# EasyEDA Pro project 栏杆机费显主板.epro, board PCB1
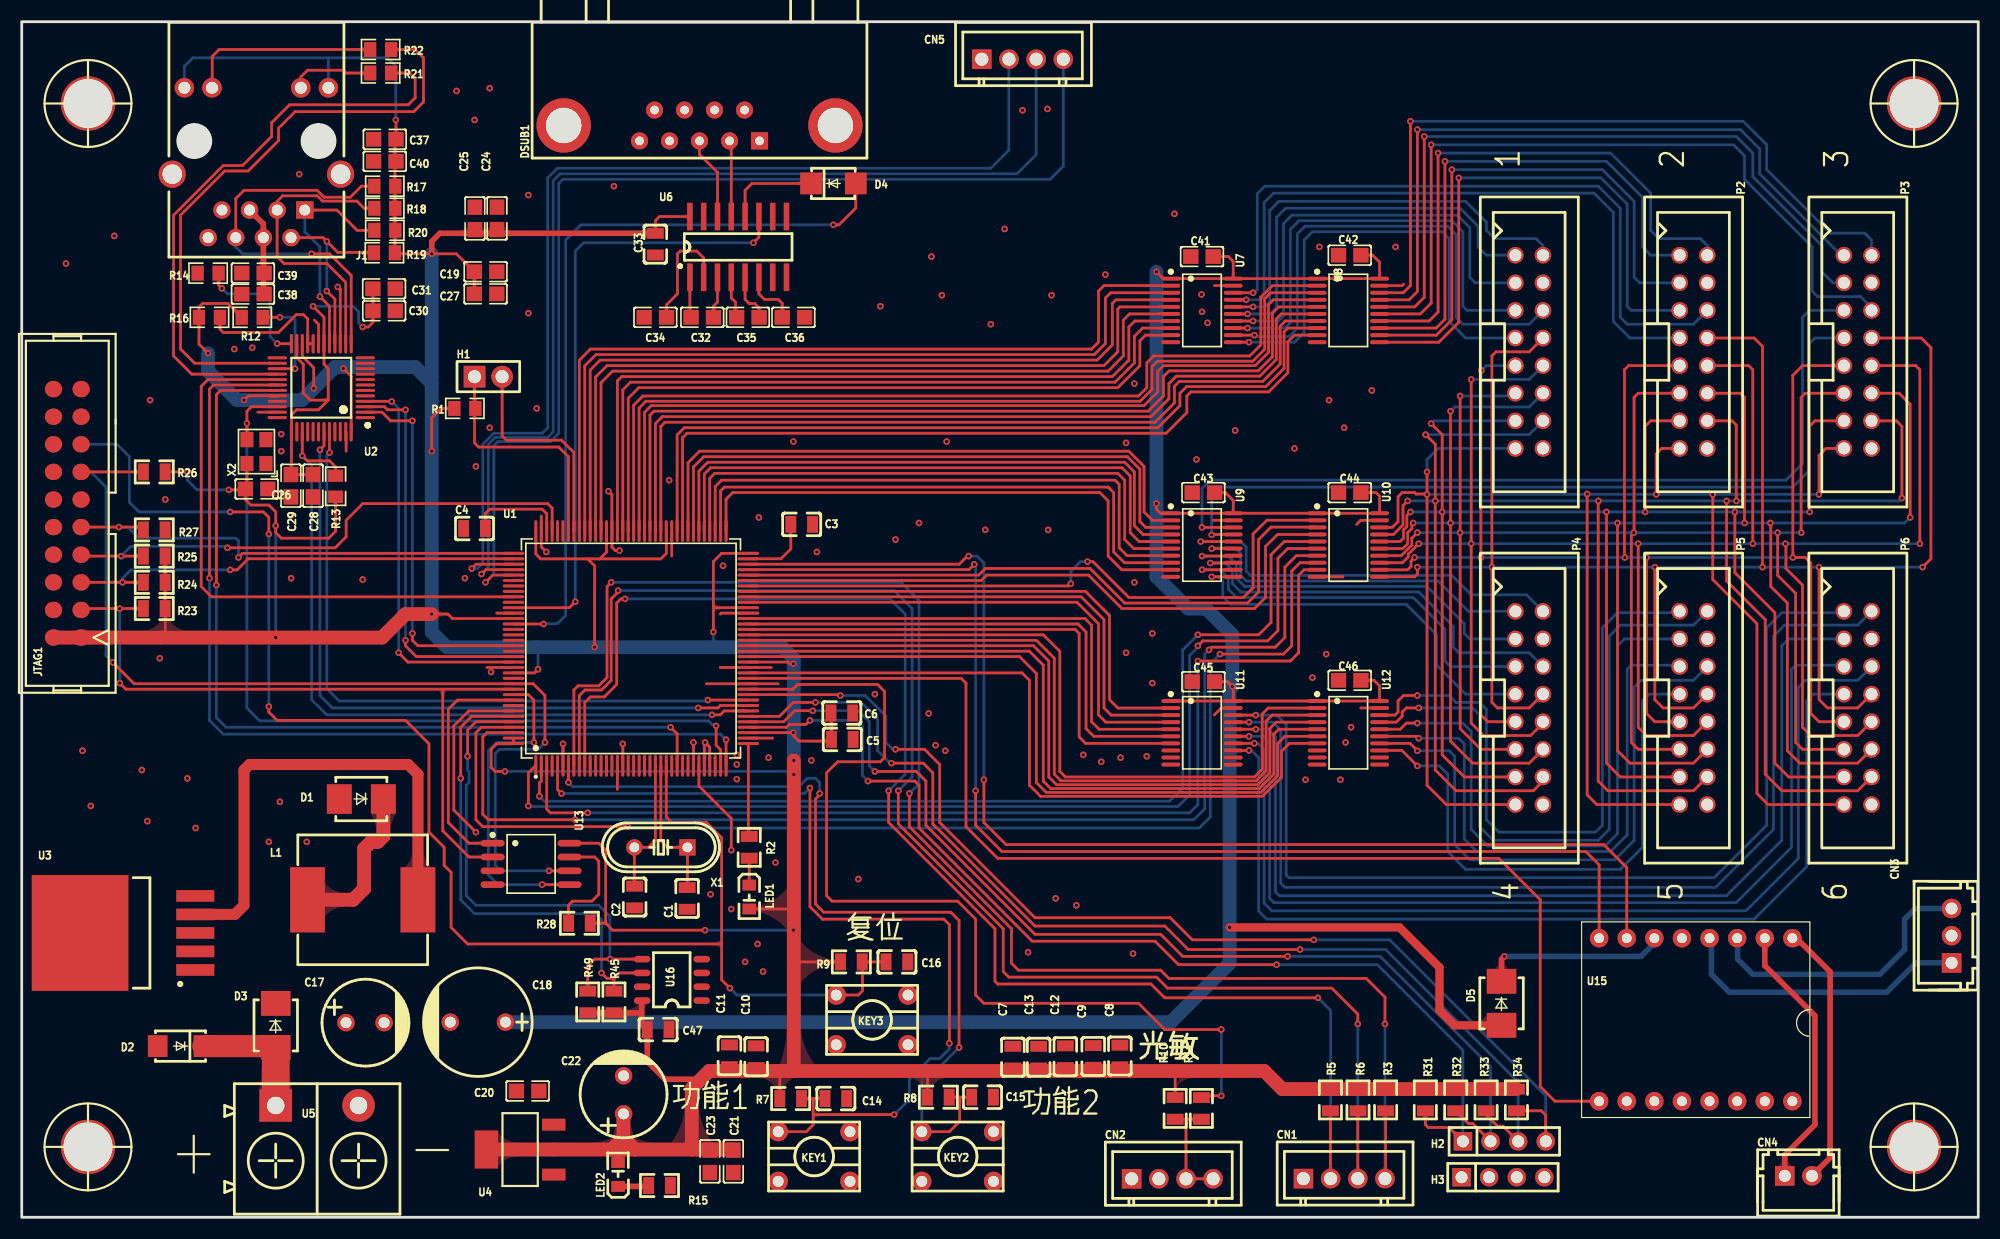
[diagram p3: board, top side]
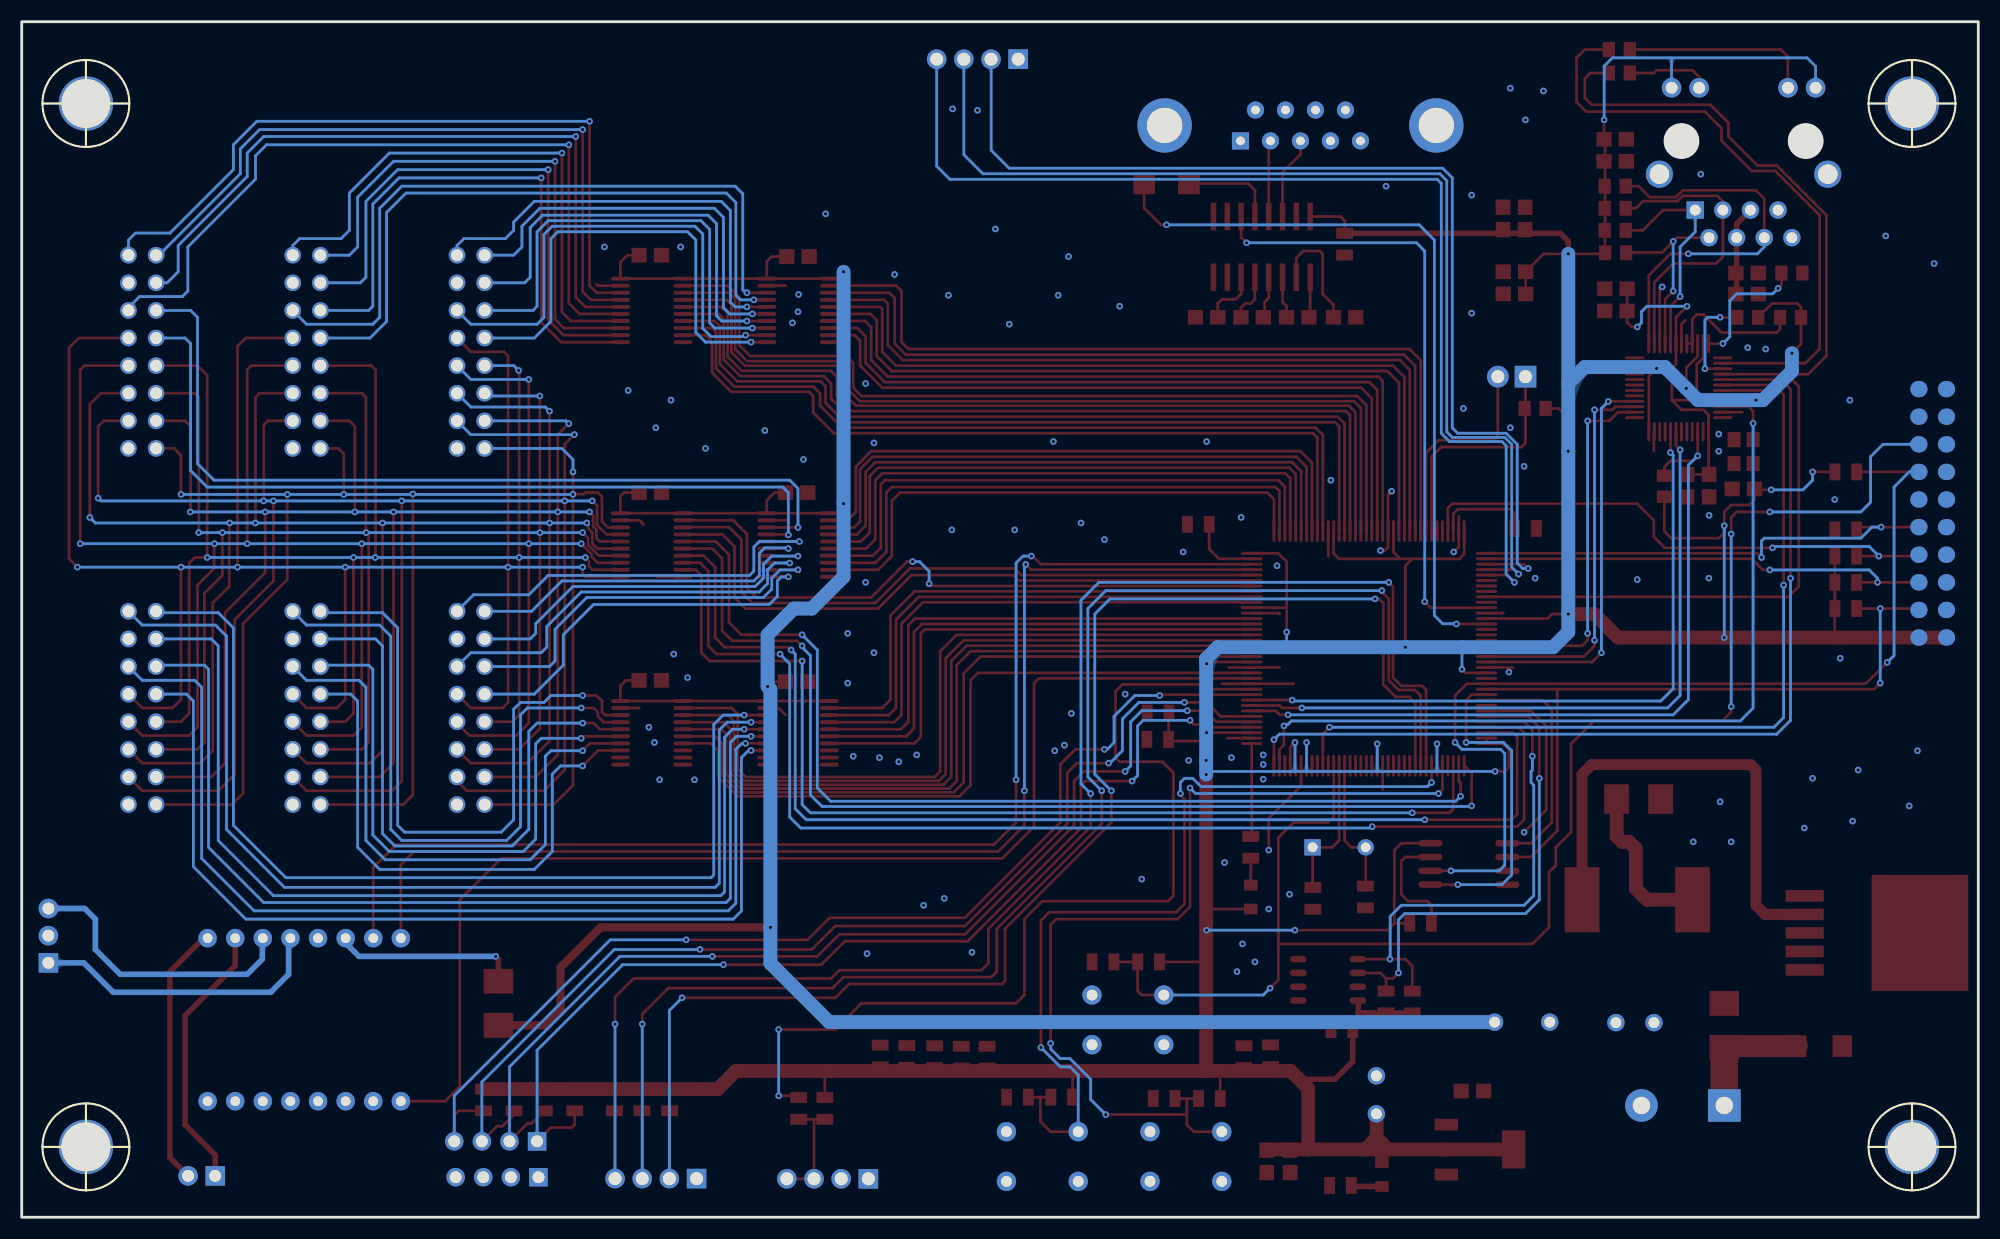
[diagram p4: board, bottom side, seen from below]

Outline 180 x 110 mm; copper layers: Top Layer, Bottom Layer. Coordinates in mm from the lower left corner of the outline.
Outline path: rectangle 0,110 180,0
Stack: Top Layer 0.035mm / Dielectric1 1.51mm FR4 er 4.5 / Bottom Layer 0.035mm

## Design rules (mm)
template: 自定义配置
spacing copperThickness1oz (default): track to track 0.102, other pairs 0.152 to 0.3
spacing copperThickness2oz: track to track 0.203, other pairs 0.152 to 0.3
track width copperThickness1oz (default): min 0.127, default 0.254, max 2.54
track width copperThickness2oz: min 0.203, default 0.254, max 2.54
differential pair differentialPair (default): width min 0.127, default 0.254, max 2.54; gap min 0.152, default 0.152
via viaSize (default): diameter min 0.5, default 0.61, max 10; hole min 0.3, default 0.305, max 6.299
net +5V uses 电源
net $2N1483 uses 电源
net +12V uses 电源

## Placement (name value [footprint] x y rotation side)
C1  22pF  [C0805]  61.21 29.34 90 top
C2  22pF  [C0805]  56.39 29.46 90 top
C3  225  [C0805]  71.75 63.75 180 top
C4  225  [C0805]  41.66 63.37 0 top
C5  104  [C0805]  75.49 43.97 180 top
C6  104  [C0805]  75.45 46.4 180 top
C7  104  [C0805]  91.19 14.73 270 top
C8  104  [C0805]  101.03 14.84 270 top
C9  104  [C0805]  98.58 14.79 270 top
C10  104  [C0805]  67.56 14.77 270 top
C11  104  [C0805]  65.11 14.86 270 top
C12  104  [C0805]  96.01 14.77 270 top
C13  225  [C0805]  93.56 14.73 90 top
C14  104  [C0805]  74.9 10.92 0 top
C15  104  [C0805]  88.39 11.05 0 top
C16  104  [C0805]  80.52 23.5 0 top
C17  330uF  [直插电容C1]  31.62 17.91 90 top
C18  1000uF  [直插电容2]  40.77 15.75 90 top
C19  104  [C0805#2]  42.67 87 0 top
C20  104  [C0805#2]  46.54 11.62 0 top
C21  106  [C0805#2]  65.47 5.14 90 top
C22  330uF  [直插电容C1]  55.37 11.3 180 top
C23  104  [C0805#2]  63.31 5.14 90 top
C24  104  [C0805#2]  43.73 91.91 270 top
C25  104  [C0805#2]  41.69 91.9 270 top
C26  104  [C0805#2]  21.61 67.01 180 top
C27  103  [C0805#2]  42.67 84.96 180 top
C28  104  [C0805#2]  26.8 67.31 90 top
C29  104  [C0805#2]  24.76 67.31 90 top
C30  104  [C0805#2]  33.34 83.4 180 top
C31  106  [C0805#2]  33.33 85.43 180 top
C32  104  [C0805#2]  62.61 82.8 180 top
C33  104  [C0805]  58.29 89.54 90 top
C34  104  [C0805#2]  58.29 82.8 0 top
C35  104  [C0805#2]  66.8 82.8 180 top
C36  104  [C0805#2]  70.99 82.8 180 top
C37  100nF  [C0805#2]  33.4 99.19 0 top
C38  104  [C0805#2]  21.27 84.94 180 top
C39  100nF  [C0805#2]  21.27 86.88 180 top
C40  100nF  [C0805#2]  33.4 97.16 0 top
C41  104  [C0805#2]  108.58 88.39 180 top
C42  104  [C0805#2]  122.17 88.52 180 top
C43  104  [C0805#2]  108.71 66.68 180 top
C44  104  [C0805#2]  122.17 66.68 180 top
C45  104  [C0805#2]  108.71 49.28 180 top
C46  104  [C0805#2]  122.17 49.4 180 top
C47  104  [C0805]  58.55 17.27 180 top
CN1  XH-4AK M  [CONN-TH_4P-P2.50_XH-4A]  121.67 3.56 0 top
CN2  XH-4AK M  [CONN-TH_4P-P2.50_XH-4A]  105.86 3.54 0 top
CN3  HX25003-3A  [CONN-TH_3P-P2.50_HX25003-3A]  177.55 25.91 270 top
CN4  HX25003-2A  [CONN-TH_2P-P2.50_HX25003-2A]  163.45 3.81 0 top
CN5  XH-4AK M  [CONN-TH_4P-P2.50_XH-4A]  92.07 106.55 0 top
D1  SS34-B  [SMB_L4.6-W3.6-LS5.3-RD]  31.24 38.48 180 top
D2  SMAJ25A_C466027  [SMA_L4.4-W2.8-LS5.4-RD]  14.6 15.75 180 top
D3  SS34-B  [SMB_L4.6-W3.6-LS5.3-RD]  23.37 17.65 270 top
D4  SS14  [SMA_L4.3-W2.6-LS5.2-FD]  74.68 95.12 180 top
D5  SS34-B  [SMB_L4.6-W3.6-LS5.3-RD]  136.14 19.69 270 top
DSUB1  DMR-9P  [DSUB-TH_DMR-9P]  62.36 100.46 90 top
H1  -  [HDR-TH_2P-P2.54-V-F]  42.93 77.34 0 top
H2  -  [HDR-TH_4P-P2.54-V-M]  136.4 6.99 0 top
H3  -  [HDR-TH_4P-P2.54-V-M]  136.27 3.68 0 top
J1  HY911105AE  [RJ45-TH_HR911105A]  21.59 97.03 180 top
JTAG1  JTAG  [JTAG_20]  4.19 64.77 90 top
KEY1  RESET  [按键]  77.85 8.51 180 top
KEY2  RESET  [按键]  91.06 8.51 180 top
KEY3  RESET  [按键]  83.19 21.08 180 top
L1  100uH  [IND-SMD_L12.0-W12.0_SLH1207S]  31.37 29.21 0 top
LED1  -  [LED0805-RD_RED]  66.93 29.46 270 top
LED2  -  [LED0805-RD_RED]  54.86 3.94 90 top
P1  2.54-2*8P简牛  [IDC-TH_16P-P2.54_C3406]  138.68 79.63 270 top
P2  2.54-2*8P简牛  [IDC-TH_16P-P2.54_C3406]  153.8 79.63 270 top
P3  2.54-2*8P简牛  [IDC-TH_16P-P2.54_C3406]  168.91 79.63 270 top
P4  2.54-2*8P简牛  [IDC-TH_16P-P2.54_C3406]  138.68 46.86 270 top
P5  2.54-2*8P简牛  [IDC-TH_16P-P2.54_C3406]  153.8 46.86 270 top
P6  2.54-2*8P简牛  [IDC-TH_16P-P2.54_C3406]  168.91 46.86 270 top
R1  10K  [R0805#2]  40.77 74.42 180 top
R2  270  [R0805]  66.93 34.04 90 top
R3  10K  [R0805]  125.48 10.8 90 top
R5  10K  [R0805]  120.4 10.8 90 top
R6  10K  [R0805]  122.94 10.8 90 top
R7  10K  [R0805]  70.74 10.92 0 top
R8  10K  [R0805]  84.33 11.05 0 top
R9  10K  [R0805]  76.33 23.5 0 top
R10  47K  [R0805]  106.11 10.02 270 top
R11  1K  [R0805]  108.53 10.02 270 top
R12  2.2K  [R0805#2]  21.21 82.8 180 top
R13  2.2K  [R0805#2]  28.88 67.26 90 top
R14  4.87K  [R0805#2]  17.15 86.87 0 top
R15  1K  [R0805]  58.67 2.92 0 top
R16  2.2K  [R0805#2]  17.27 82.8 180 top
R17  49.9R  [R0805#2]  33.4 94.87 180 top
R18  49.9R  [R0805#2]  33.4 92.84 180 top
R19  49.9R  [R0805#2]  33.37 88.74 0 top
R20  49.9R  [R0805#2]  33.4 90.81 0 top
R21  330R  [R0805#2]  33.02 105.28 180 top
R22  330R  [R0805#2]  33.02 107.44 180 top
R23  10K  [R0805]  12.19 56.01 0 top
R24  10K  [R0805]  12.19 58.42 0 top
R25  10K  [R0805]  12.19 60.83 0 top
R26  10K  [R0805]  12.19 68.58 0 top
R27  10K  [R0805]  12.19 63.25 0 top
R28  10K  [R0805]  51.31 27.05 180 top
R31  10K  [R0805]  129.13 10.8 90 top
R32  10K  [R0805]  131.92 10.8 90 top
R33  10K  [R0805]  134.72 10.8 90 top
R34  10K  [R0805]  137.51 10.8 90 top
R45  4.7K  [R0805]  54.48 19.81 90 top
R49  4.7K  [R0805]  52.07 19.81 90 top
U1  -  [STM32F407ZET6]  41.15 54.74 0 top
U2  DP83848IVVX/NOPB  [LQFP-48_L7.0-W7.0-P0.50-LS9.0-TL]  27.56 76.33 180 top
U3  LM2596S-5.0  [TO-263-5_L10.6-W9.6-P1.70-LS15.9-BR]  10.67 26.16 0 top
U4  AMS1117-3.3_C165482  [SOT-223_L6.5-W3.5-P2.30-LS7.0-BR]  45.85 6.22 0 top
U5  KF7.62-2P  [CONN-TH_2P-P7.62_KEFA_KF7.62-2P]  27.18 10.29 0 top
U6  MAX3232CDR  [NSOP-16_L9.9-W3.9-P1.27-LS6.0-BL]  65.91 89.28 0 top
U7  SN74HC245PWR  [TSSOP-20_L6.5-W4.4-P0.65-LS6.4-BL]  108.58 83.44 270 top
U8  SN74HC245PWR  [TSSOP-20_L6.5-W4.4-P0.65-LS6.4-BL]  122.05 83.44 270 top
U9  SN74HC245PWR  [TSSOP-20_L6.5-W4.4-P0.65-LS6.4-BL]  108.58 61.85 270 top
U10  SN74HC245PWR  [TSSOP-20_L6.5-W4.4-P0.65-LS6.4-BL]  122.05 61.85 270 top
U11  SN74HC245PWR  [TSSOP-20_L6.5-W4.4-P0.65-LS6.4-BL]  108.58 44.58 270 top
U12  SN74HC245PWR  [TSSOP-20_L6.5-W4.4-P0.65-LS6.4-BL]  122.05 44.58 270 top
U13  GT30L32S4W  [SOP-8_L5.3-W5.3-P1.27-LS8.0-BL]  46.86 32.51 270 top
U15  b2b2b2a82eb44742a801b562c82f46ac  [BY8301]  143.51 27.18 270 top
U16  24C02/TR  [SOIC-8_L5.0-W4.0-P1.27-LS6.0-BL]  59.82 21.84 90 top
U17  -  [M4螺丝]  6.1 102.48 0 top
U18  -  [M4螺丝]  6.1 6.48 0 top
U19  -  [M4螺丝]  174.1 6.48 0 top
U20  -  [M4螺丝]  174.1 102.48 0 top
X1  -  [HC-49US_L11.5-W4.5-P4.88]  58.8 34.04 180 top
X2  50MHz  [OSC-SMD_4P-L3.2-W2.5-BL]  21.59 70.45 90 top

## Footprints (pads in the part's own frame, mm; a bottom-side part is the same pattern mirrored in y, then rotated)
BY8301
  round 1.7 hole 0.9x0.905: 1(1.5,19.39) 2(1.5,16.85) 3(1.5,14.31) 4(1.5,11.77) 5(1.5,9.23) 6(1.5,6.69) 7(1.5,4.15) 9(16.5,1.61) 10(16.5,4.15) 11(16.5,6.69) 12(16.5,9.23) 13(16.5,11.77) 14(16.5,14.31) 15(16.5,16.85) 16(16.5,19.39)
  round 1.7 hole 0.9: 8(1.5,1.61)
C0805
  rect 1x1.55 smd: 1(-1,0) 2(1,0)
C0805#2
  rect 1.41x1.35 smd: 1(-1.03,0) 2(1.03,0)
CONN-TH_2P-P2.50_HX25003-2A
  rect 1.8x1.8 hole 1.1: 1(-1.25,0)
  round 1.8 hole 1.1: 2(1.25,0)
CONN-TH_2P-P7.62_KEFA_KF7.62-2P
  rect 3x3 hole 1.6: 1(-3.81,0)
  round 3 hole 1.6: 2(3.81,0)
CONN-TH_3P-P2.50_HX25003-3A
  rect 1.8x1.8 hole 1.1: 1(2.5,0)
  round 1.8 hole 1.1: 2(0,0) 3(-2.5,0)
CONN-TH_4P-P2.50_XH-4A
  rect 1.8x1.8 hole 1.199: 1(-3.751,0)
  round 1.8 hole 1.199: 2(-1.248,0) 3(1.251,0) 4(3.751,0)
DSUB-TH_DMR-9P
  rect 1.575x1.575 hole 0.8: 1(-1.42,-5.52)
  round 1.575 hole 0.8: 2(-1.42,-2.76) 3(-1.42,0) 4(-1.42,2.76) 5(-1.42,5.52) 6(1.42,-4.14) 7(1.42,-1.38) 8(1.42,1.38) 9(1.42,4.14)
  round 5 hole 3.25: 10(0,12.5) 11(0,-12.5)
HC-49US_L11.5-W4.5-P4.88
  rect 1.501x1.501 hole 0.899: 1(-2.441,0)
  round 1.501 hole 0.899: 2(2.441,0)
HDR-TH_2P-P2.54-V-F
  rect 1.999x1.999 hole 1.199: 1(-1.27,0)
  round 1.999 hole 1.199: 2(1.27,0)
HDR-TH_4P-P2.54-V-M
  rect 1.7x1.7 hole 1.1: 1(-3.81,0)
  round 1.7 hole 1.1: 2(-1.27,0) 3(1.27,0) 4(3.81,0)
IDC-TH_16P-P2.54_C3406
  round 1.524 hole 1.1: 1(-8.89,-1.27) 2(-8.89,1.27) 3(-6.35,-1.27) 4(-6.35,1.27) 5(-3.81,-1.27) 6(-3.81,1.27) 7(-1.27,-1.27) 8(-1.27,1.27) 9(1.27,-1.27) 10(1.27,1.27) 11(3.81,-1.27) 12(3.81,1.27) 13(6.35,-1.27) 14(6.35,1.27) 15(8.89,-1.27) 16(8.89,1.27)
IND-SMD_L12.0-W12.0_SLH1207S
  rect 3.2x6 smd: 1(-5.08,0) 2(5.08,0)
JTAG_20
  custom 1.499x1.573 hole 0.905x0.9: 1(-11.43,-1.27) 2(-11.43,1.27) 11(1.27,-1.27) 17(8.89,-1.27) 19(11.43,-1.27)
  custom 1.499x1.573 hole 0.9x0.905: 3(-8.89,-1.27) 4(-8.89,1.27) 5(-6.35,-1.27) 6(-6.35,1.27) 7(-3.81,-1.27) 8(-3.81,1.27) 9(-1.27,-1.27) 10(-1.27,1.27) 12(1.27,1.27) 13(3.81,-1.27) 14(3.81,1.27) 15(6.35,-1.27) 16(6.35,1.27) 18(8.89,1.27) 20(11.43,1.27)
LED0805-RD_RED
  rect 1x1.25 smd: 1(-1.1,0) 2(1.1,0)
LQFP-48_L7.0-W7.0-P0.50-LS9.0-TL
  oval 1.8x0.28 smd: 1(-4.05,2.75) 2(-4.05,2.25) 3(-4.05,1.75) 4(-4.05,1.25) 5(-4.05,0.75) 6(-4.05,0.25) 7(-4.05,-0.25) 8(-4.05,-0.75) 9(-4.05,-1.25) 10(-4.05,-1.75) 11(-4.05,-2.25) 12(-4.05,-2.75) 25(4.05,-2.75) 26(4.05,-2.25) 27(4.05,-1.75) 28(4.05,-1.25) 29(4.05,-0.75) 30(4.05,-0.25) 31(4.05,0.25) 32(4.05,0.75) 33(4.05,1.25) 34(4.05,1.75) 35(4.05,2.25) 36(4.05,2.75)
  oval 0.28x1.8 smd: 13(-2.75,-4.05) 14(-2.25,-4.05) 15(-1.75,-4.05) 16(-1.25,-4.05) 17(-0.75,-4.05) 18(-0.25,-4.05) 19(0.25,-4.05) 20(0.75,-4.05) 21(1.25,-4.05) 22(1.75,-4.05) 23(2.25,-4.05) 24(2.75,-4.05) 37(2.75,4.05) 38(2.25,4.05) 39(1.75,4.05) 40(1.25,4.05) 41(0.75,4.05) 42(0.25,4.05) 43(-0.25,4.05) 44(-0.75,4.05) 45(-1.25,4.05) 46(-1.75,4.05) 47(-2.25,4.05) 48(-2.75,4.05)
M4螺丝
  round 5 hole 4.5: 1(0,0)
NSOP-16_L9.9-W3.9-P1.27-LS6.0-BL
  rect 0.508x2.54 smd: 1(-4.445,-2.794) 2(-3.175,-2.794) 3(-1.905,-2.794) 4(-0.635,-2.794) 5(0.635,-2.794) 6(1.905,-2.794) 7(3.175,-2.794) 8(4.445,-2.794) 9(4.445,2.794) 10(3.175,2.794) 11(1.905,2.794) 12(0.635,2.794) 13(-0.635,2.794) 14(-1.905,2.794) 15(-3.175,2.794) 16(-4.445,2.794)
OSC-SMD_4P-L3.2-W2.5-BL
  rect 1.4x1.2 smd: 1(-1.1,-0.875) 2(1.1,-0.875) 3(1.1,0.875) 4(-1.1,0.875)
R0805
  rect 1x1.55 smd: 1(-1,0) 2(1,0)
R0805#2
  rect 1.133x1.377 smd: 1(-0.966,0) 2(0.966,0)
RJ45-TH_HR911105A
  rect 1.6x1.6 hole 1: 1(-4.45,4.355)
  round 1.6 hole 1: 2(-3.18,6.895) 3(-1.91,4.355) 4(-0.64,6.895) 5(0.63,4.355) 6(1.9,6.895) 7(3.17,4.355) 8(4.44,6.895)
  round 1.8 hole 1.1: 9(-6.625,-6.895) 10(-4.085,-6.895) 11(4.085,-6.895) 12(6.625,-6.895)
  round 2.5 hole 1.8: SH1(-7.745,1.055) SH2(7.745,1.055)
SMA_L4.3-W2.6-LS5.2-FD
  rect 2x2 smd: 1(-2.058,0) 2(2.058,0)
SMA_L4.4-W2.8-LS5.4-RD
  rect 1.8x2 smd: 1(-2.1,0) 2(2.1,0)
SMB_L4.6-W3.6-LS5.3-RD
  rect 2.29x2.72 smd: 1(-2.025,0) 2(2.025,0)
SOIC-8_L5.0-W4.0-P1.27-LS6.0-BL
  oval 0.6x1.52 smd: 1(-1.905,-2.74) 2(-0.634,-2.74) 3(0.635,-2.74) 4(1.905,-2.74) 5(1.905,2.74) 6(0.635,2.74) 7(-0.634,2.74) 8(-1.905,2.74)
SOP-8_L5.3-W5.3-P1.27-LS8.0-BL
  oval 0.609x2.204 smd: 1(-1.905,-3.542) 2(-0.635,-3.542) 3(0.635,-3.542) 4(1.905,-3.542) 5(1.905,3.542) 6(0.635,3.542) 7(-0.635,3.542) 8(-1.905,3.542)
SOT-223_L6.5-W3.5-P2.30-LS7.0-BR
  rect 2.159x1.092 smd: 1(3.099,-2.299) 2(3.099,0.013) 3(3.099,2.299)
  rect 2.159x3.505 smd: 4(-3.099,0.013)
STM32F407ZET6
  oval 0.28x2 smd: 1(6.149,-13.2) 2(6.649,-13.2) 3(7.149,-13.2) 4(7.649,-13.2) 5(8.149,-13.2) 6(8.649,-13.2) 7(9.149,-13.2) 8(9.649,-13.2) 9(10.149,-13.2) 10(10.649,-13.2) 11(11.149,-13.2) 12(11.649,-13.2) 13(12.149,-13.2) 14(12.649,-13.2) 15(13.149,-13.2) 16(13.649,-13.2) 17(14.149,-13.2) 18(14.649,-13.2) 19(15.149,-13.2) 20(15.649,-13.2) 21(16.149,-13.2) 22(16.649,-13.2) 23(17.149,-13.2) 24(17.649,-13.2) 25(18.149,-13.2) 26(18.649,-13.2) 27(19.149,-13.2) 28(19.649,-13.2) 29(20.149,-13.2) 30(20.649,-13.2) 31(21.149,-13.2) 32(21.649,-13.2) 33(22.149,-13.2) 34(22.649,-13.2) 35(23.149,-13.2) 36(23.649,-13.2) 73(23.649,8.4) 74(23.149,8.4) 75(22.649,8.4) 76(22.149,8.4) 77(21.649,8.4) 78(21.149,8.4) 79(20.649,8.4) 80(20.149,8.4) 81(19.649,8.4) 82(19.149,8.4) 83(18.649,8.4) 84(18.149,8.4) 85(17.649,8.4) 86(17.149,8.4) 87(16.649,8.4) 88(16.149,8.4) 89(15.649,8.4) 90(15.149,8.4) 91(14.649,8.4) 92(14.149,8.4) 93(13.649,8.4) 94(13.149,8.4) 95(12.649,8.4) 96(12.149,8.4) 97(11.649,8.4) 98(11.149,8.4) 99(10.649,8.4) 100(10.149,8.4) 101(9.649,8.4) 102(9.149,8.4) 103(8.649,8.4) 104(8.149,8.4) 105(7.649,8.4) 106(7.149,8.4) 107(6.649,8.4) 108(6.149,8.4)
  oval 2x0.28 smd: 37(25.699,-11.15) 38(25.699,-10.65) 39(25.699,-10.15) 40(25.699,-9.65) 41(25.699,-9.15) 42(25.699,-8.65) 43(25.699,-8.15) 44(25.699,-7.65) 45(25.699,-7.15) 46(25.699,-6.65) 47(25.699,-6.15) 48(25.699,-5.65) 49(25.699,-5.15) 50(25.699,-4.65) 51(25.699,-4.15) 52(25.699,-3.65) 53(25.699,-3.15) 54(25.699,-2.65) 55(25.699,-2.15) 56(25.699,-1.65) 57(25.699,-1.15) 58(25.699,-0.65) 59(25.699,-0.15) 60(25.699,0.35) 61(25.699,0.85) 62(25.699,1.35) 63(25.699,1.85) 64(25.699,2.35) 65(25.699,2.85) 66(25.699,3.35) 67(25.699,3.85) 68(25.699,4.35) 69(25.699,4.85) 70(25.699,5.35) 71(25.699,5.85) 72(25.699,6.35) 109(4.099,6.35) 110(4.099,5.85) 111(4.099,5.35) 112(4.099,4.85) 113(4.099,4.35) 114(4.099,3.85) 115(4.099,3.35) 116(4.099,2.85) 117(4.099,2.35) 118(4.099,1.85) 119(4.099,1.35) 120(4.099,0.85) 121(4.099,0.35) 122(4.099,-0.15) 123(4.099,-0.65) 124(4.099,-1.15) 125(4.099,-1.65) 126(4.099,-2.15) 127(4.099,-2.65) 128(4.099,-3.15) 129(4.099,-3.65) 130(4.099,-4.15) 131(4.099,-4.65) 132(4.099,-5.15) 133(4.099,-5.65) 134(4.099,-6.15) 135(4.099,-6.65) 136(4.099,-7.15) 137(4.099,-7.65) 138(4.099,-8.15) 139(4.099,-8.65) 140(4.099,-9.15) 141(4.099,-9.65) 142(4.099,-10.15) 143(4.099,-10.65) 144(4.099,-11.15)
TO-263-5_L10.6-W9.6-P1.70-LS15.9-BR
  rect 3.5x1.069 smd: 1(5.3,-3.404) 2(5.3,-1.702) 3(5.3,0) 4(5.3,1.702) 5(5.3,3.404)
  rect 8.89x10.66 smd: 6(-5.3,0)
TSSOP-20_L6.5-W4.4-P0.65-LS6.4-BL
  oval 0.364x1.742 smd: 1(-2.925,-2.871) 2(-2.275,-2.871) 3(-1.625,-2.871) 4(-0.975,-2.871) 5(-0.325,-2.871) 6(0.325,-2.871) 7(0.975,-2.871) 8(1.625,-2.871) 9(2.275,-2.871) 10(2.925,-2.871) 11(2.925,2.871) 12(2.275,2.871) 13(1.625,2.871) 14(0.975,2.871) 15(0.325,2.871) 16(-0.325,2.871) 17(-0.975,2.871) 18(-1.625,2.871) 19(-2.275,2.871) 20(-2.925,2.871)
按键
  round 1.778 hole 1: 1(8.255,0.635) 2(8.255,5.207) 3(1.651,5.207) 4(1.651,0.635)
直插电容2
  round 1.6 hole 1: 1(2.206,-3.735) 2(2.206,1.345)
直插电容C1
  round 1.6 hole 1: 1(-0.001,1.788) 2(-0.001,-1.712)

## Nets
As in the schematic.

Pads without a net: DSUB1 1 4 6 7 8 9; J1 7; JTAG1 11 17 19; KEY1 3 4; KEY2 3 4; KEY3 3 4; U1 124 127; U2 1 5 6 7 8 9 10 11 12 25 33 38 40 41 42 45 46; U6 7 8 9 10; U17 1; U18 1; U19 1; U20 1; X2 1

## Via types
v1: diameter 0.61, hole 0.305, Top Layer to Bottom Layer, 327 vias

## Routing (per net, layer and track width the routed paths; a pad name or vN(x,y) marks a point on that pad's centre or on a via; arc(x,y) is an arc through that point)
+3.3V: length 618.7
  Top Layer w0.254: C26.2 20.72,67.15 X2.4 ; C26.2 20.58,66.03 21.08,65.53 22.73,65.53 23.37,64.9 v1(23.37,63.63) 23.37,62.99 23.88,62.48 28.24,62.48 28.88,63.12 R13.1 ; C26.2 20.54,67.06 20.41,66.93 v1(19.05,66.93) ; U1.131 47.17,50.09 v1(47.5,50.42) ; 105.54,13.46 106.11,12.88 R10.1 ; U1.17 v1(55.3,43.56) ; U1.143 U1.144 45.22,43.56 43.69,43.56 43.18,43.05 43.18,41.4 43.56,41.02 v1(44.45,41.02) ; v1(63.63,53.85) 63.63,56.09 ; 63.63,56.09 U1.62 ; 63.63,56.09 63.63,60.33 64.39,61.09 U1.72 ; 53.18,60.58 52.07,60.58 ; 53.18,60.58 53.8,61.2 U1.95 ; 53.18,60.58 58.8,60.58 59.31,61.09 59.31,63.12 U1.84 ; 52.07,60.58 52.7,59.94 v1(52.7,52.45) ; 52.07,60.58 47.75,60.58 47.3,61.03 U1.108 ; U13.8 53.09,34.42 53.72,33.78 53.72,27.05 ; U1.33 63.3,43.26 v1(62.87,43.69) 62.8,43.62 U1.32 ; U6.16 58.67,92.08 58.29,91.69 C33.2 ; 53.72,27.05 R28.1 ; 53.72,27.05 54.36,26.42 v1(62.87,26.42) ; 71.03,23.46 71.06,23.5 R9.1 ; 12.83,53.34 13.21,53.72 13.21,55.99 R23.2 R24.2 R25.2 ; U1.30 v1(61.8,43.69) ; v1(29.59,78.11) 30.31,77.39 U2.48 ; R7.1 69.74,13.45 69.75,13.46 ; v1(70.99,26.42) 71.03,26.38 ; R8.1 83.33,13.43 83.36,13.46 ; v1(34.42,100.97) 34.43,100.95 C37.2 34.33,99.09 R19.2 34.43,88.65 v1(37.72,88.65) 39.99,88.65 C19.1 C27.2 ; LED1.2 70.97,28.36 71.03,28.31 ; U2.22 25.81,79.22 26.86,78.17 v1(26.86,76.27) ; v1(20.45,75.18) 20.84,75.58 U2.32 ; v1(70.99,50.93) 70.64,50.93 70.48,51.09 U1.52 ; R12.2 18.97,84.07 16.64,84.07 16.31,83.74 R16.2 16.31,80.34 v1(17.15,79.5) ; R26.2 v1(15.24,68.58) ; U1.6 v1(49.8,43.56) ; R1.2 38.61,74.42 37.72,73.53 v1(37.72,70.49) ; U1.121 39.62,55.09 39.21,55.5 v1(37.72,55.5) ; C6.2 74.49,46.36 C5.2 74.34,43.82 71.5,43.82 70.99,44.32 v1(70.99,44.59) U1.39
  Top Layer w0.508: R49.1 52.08,18.8 57.04,18.8 ; U16.8 57.04,19.9 57.04,18.8 ; 57.04,18.8 57.04,17.78 C47.2 57.55,14.34 59.18,12.7 62.1,12.7 ; C33.2 38.46,90.54 37.72,89.79 v1(37.72,88.65)
  Top Layer w0.762: LED2.2 54.86,6.22
  Top Layer w1.27: R34.2 R33.2 R32.2 R31.2 R3.2 R6.2 R5.2 115.97,11.8 114.3,13.46 71.03,13.46 ; 55.35,6.24 55.35,7.31 ; 55.35,6.24 54.27,6.24 ; 55.35,6.24 56.43,6.24 ; 55.35,7.31 54.27,6.24 ; 55.35,7.31 55.35,9.49 C22.1 ; 55.35,7.31 56.43,6.24 ; U4.4 54.27,6.24 ; v1(37.72,55.5) 35.31,55.5 33.15,53.34 v1(23.37,53.34) JTAG1.1 JTAG1.2 ; 61.64,6.24 65.41,6.24 C21.2 ; 61.64,6.24 56.43,6.24 ; 61.64,6.24 61.64,11.86 63.25,13.46 71.03,13.46 ; 71.03,13.46 v1(71.03,40.74) v1(71.03,42.04)
  Bottom Layer w0.254: 62.9,41.02 70.75,41.02 v1(71.03,40.74) ; 62.9,41.02 61.71,41.02 ; 62.9,41.02 62.87,41.05 v1(62.87,43.69) ; v1(19.05,66.93) 16.13,66.93 15.24,67.82 v1(15.24,68.58) ; v1(44.45,41.02) 49.78,41.02 ; 49.78,41.02 55.38,41.02 ; 49.78,41.02 49.8,41.04 v1(49.8,43.56) ; v1(47.5,50.42) 47.5,52.38 47.42,52.45 ; 61.71,41.02 55.38,41.02 ; 61.71,41.02 61.8,41.11 v1(61.8,43.69) ; 55.38,41.02 55.3,41.1 v1(55.3,43.56) ; v1(70.99,44.59) 71.03,44.55 ; J1.12 14.96,105.9 15.75,106.68 33.65,106.68 34.42,105.92 v1(34.42,100.97) ; J1.9 28.21,106.68 ; 63.68,52.45 63.63,52.5 v1(63.63,53.85) ; v1(62.87,26.42) v1(70.99,26.42) ; v1(29.59,78.11) 29.59,78.23 29.6,78.23 ; v1(70.99,50.93) 71.03,50.96 ; v1(23.37,63.63) v1(23.37,53.34)
  Bottom Layer w1.27: 37.72,76.71 36.2,78.23 28.83,78.23 v1(26.86,76.27) 25.78,75.18 v1(20.45,75.18) 19.81,75.18 17.15,77.85 v1(17.15,79.5) ; 37.72,76.71 v1(37.72,70.49) v1(37.72,55.5) 37.72,53.85 39.12,52.45 v1(52.7,52.45) 69.98,52.45 71.03,51.4 v1(71.03,42.04) v1(71.03,40.74) ; 37.72,76.71 v1(37.72,88.65)
+5V: length 294.3
  Top Layer w0.254: U11.20 U11.1 ; U11.20 U12.1 124.92,47.5 124.92,48.9 124.41,49.4 C46.1 ; U11.20 111.46,48.77 110.95,49.28 C45.1 ; U7.20 U8.1 124.92,86.36 124.92,87.88 124.28,88.52 C42.1 ; U7.20 111.46,87.95 111.01,88.39 C41.1 ; U7.20 U7.1 105.02,86.36 v1(104.39,87) ; 104.39,65.66 104.39,65.15 104.77,64.77 111.46,64.77 ; C44.1 124.6,66.68 124.92,66.36 124.92,64.77 111.46,64.77 ; 111.46,64.77 111.46,65.96 110.74,66.68 C43.1
  Top Layer w0.762: D5.2 131.82,17.66 130.43,19.05 130.43,22.99 126.75,26.67 v1(111.12,26.67)
  Top Layer w1.016: U3.4 19.61,27.86 20.45,28.7 20.45,41.15 20.95,41.66 35.56,41.66 36.45,40.77 L1.2
  Bottom Layer w1.27: v1(104.39,87) v1(104.39,65.66) 104.39,58.93 107.31,56.01 108.97,56.01 111.38,53.59 v1(111.38,48.83) 111.12,48.58 v1(111.12,26.67) 111.12,23.37 105.71,17.95 C18.1
GND: length 85.6
  Top Layer w0.254: 127.13,85.85 126.99,85.71 124.92,85.71 ; v1(54.99,61.34) 54.61,61.34 54.3,61.65 U1.94 54.3,66.48 v1(53.98,66.8) ; v1(29.08,85.6) 29.31,85.37 U2.15 ; U9.19 111.44,64.14 109.6,64.14 ; 124.92,46.85 124.91,46.86 123.19,46.86 ; U1.130 42.8,50.59 ; U1.61 64.35,55.59 64.26,55.5 ; v1(41.78,35.43) 39.75,37.47 39.75,45.21 41.13,46.59 U1.138 ; 62.99,49.09 U1.48 69.6,49.09 ; U1.38 69.09,44.09 ; v1(48.26,61.21) 47.8,61.68 U1.107 47.8,64.52 ; U2.19 27.31,82.17 26.92,82.55 ; 121.54,58.93 121.53,58.92 U10.10 ; U1.16 54.8,39.37 ; 111.46,46.85 110.35,46.85 109.73,46.23 ; U2.35 21.72,74.08 ; 29.84,70.49 29.84,72.24 U2.47 ; 62.3,39.68 62.3,39.62 ; 62.3,39.68 65.28,36.7 v1(65.28,33.78) ; 62.3,39.68 U1.31 ; 64.26,50.59 U1.51 68.96,50.59 ; U7.19 111.44,85.73 109.73,85.73 ; U1.83 59.8,60.83 ; 124.92,64.12 123.18,64.12 122.81,63.75 ; U1.120 43.69,55.59
  Bottom Layer w0.254: v1(54.99,61.34) 54.99,61.21
  vias: v1(4.06,87.76) v1(5.59,42.93) v1(6.35,37.85) v1(8.51,90.3) v1(11.05,41.15) v1(11.56,36.45) v1(11.81,75.18) v1(12.7,51.44) v1(13.21,66.04) v1(15.24,40.39) v1(16,35.81) v1(19.56,79.88) v1(21.21,80.01) v1(22.73,34.54) v1(23.75,38.23) v1(23.88,72.06) v1(23.88,70.49) v1(24.76,64.58) v1(24.78,58.8) v1(25.52,95.97) v1(26.22,34.54) v1(31.37,58.67) v1(40.01,103.63) v1(40.77,58.8) v1(41.66,100.97) v1(41.78,69.09) v1(43.05,103.89) v1(43.05,72.64) v1(43.18,50.17) v1(46.61,94.05) v1(46.61,83.19) v1(47.37,74.42) v1(54.48,94.87) v1(59.56,67.82) v1(63.37,29.72) v1(64.52,59.94) v1(65.28,28.36) v1(65.79,42.55) v1(65.79,41.66) v1(65.79,40.31) v1(66.55,23.5) v1(67.69,25.15) v1(67.82,64.39) v1(68.2,22.61) v1(68.71,42.29) v1(69.34,32.64) v1(70.99,71.37) v1(72.64,42.04) v1(73.15,61.21) v1(76.96,31.12) v1(78.49,48.13) v1(78.99,83.82) v1(80.39,62.36) v1(82.55,63.88) v1(83.44,46.36) v1(83.69,88.39) v1(84.07,43.43) v1(84.65,84.84) v1(84.96,42.93) v1(85.09,71.37) v1(88.65,63.25) v1(89.15,82.17) v1(90.42,90.93) v1(92.07,101.85) v1(92.58,24.38) v1(94.36,101.98) v1(94.43,63.25) v1(94.74,84.84) v1(95.12,29.34) v1(97.03,28.7) v1(97.66,42.55) v1(99.31,41.91) v1(99.69,86.74) v1(101.09,42.29) v1(101.6,71.25) v1(101.6,51.94) v1(102.23,24.26) v1(102.36,76.71) v1(102.36,58.42) v1(103.5,42.42) v1(104.01,53.72) v1(104.01,49.15) v1(106.04,92.33) v1(108.08,69.72) v1(108.53,84.9) v1(108.58,83.31) v1(109.09,82.3) v1(111.63,72.39) v1(117.09,70.74) v1(118.11,40.26) v1(118.75,49.66) v1(119.38,89.28) v1(120.01,51.82) v1(120.27,75.18) v1(121.32,40.26) v1(121.67,72.64) v1(121.79,43.69) v1(122.3,45.09) v1(124.21,76.07) v1(126.39,89.28)
A: length 111.9
  Top Layer w0.254: v1(110.24,51.82) 116.08,51.82 116.84,52.58 116.84,59.46 117.6,60.22 U10.8 ; v1(55.75,35.94) 42.42,35.94 41.78,36.58 41.78,44.58 42.29,45.09 U1.141
  Bottom Layer w0.254: v1(55.75,35.94) 55.75,35.81 108.33,35.81 109.35,36.83 109.35,50.93 v1(110.24,51.82)
AI: length 158
  Top Layer w0.254: 162.94,60.71 v1(162.94,60.71) ; 162.94,60.71 162.94,77.47 163.83,78.36 P3.9 ; 162.94,60.71 164.08,60.71 164.59,60.2 164.59,46.36 165.35,45.59 P6.9 ; 124.92,59.57 127.51,59.57 127.82,59.88 127.82,60.38 v1(128.14,60.71) ; 134.24,77.6 v1(134.24,60.71) 134.24,46.23 134.87,45.59 P4.9 ; 147.45,60.71 147.45,77.98 147.83,78.36 P2.9 ; P5.9 150.24,45.59 149.48,46.36 v1(149.48,60.71)
  Bottom Layer w0.254: v1(162.94,60.71) v1(149.48,60.71) v1(147.48,60.71) v1(134.24,60.71) v1(128.14,60.71) ; P1.9 134.72,78.36 v1(134.28,77.92)
ANJIAN1: length 144.7
  Top Layer w0.254: CN1.4 125.48,3.62 R3.1 ; v1(81.66,38.99) 81.66,35.94 91.06,26.54 91.06,23.37 91.69,22.73 104.77,22.73 105.54,21.97 123.7,21.97 125.42,20.25 v1(125.42,17.78) ; U1.8 50.8,48.51 51.18,48.9 53.09,48.9 53.85,49.66 53.85,58.04 v1(54.23,58.42)
  Bottom Layer w0.254: v1(81.66,38.99) 82.55,39.88 82.55,56.77 80.9,58.42 v1(54.23,58.42) ; CN1.4 v1(125.42,17.78)
ANJIAN2: length 139.8
  Top Layer w0.254: v1(80.64,39.24) 80.64,36.2 90.3,26.54 90.3,22.61 90.8,22.1 104.39,22.1 105.41,21.08 120.52,21.08 122.92,18.69 v1(122.92,17.78) ; v1(54.86,57.66) 54.86,57.53 54.23,56.9 54.23,49.4 53.34,48.51 51.82,48.51 51.3,48 U1.9 ; CN1.3 122.92,9.78 R6.1
  Bottom Layer w0.254: v1(80.64,39.24) 81.91,40.51 81.91,56.01 80.26,57.66 v1(54.86,57.66) ; CN1.3 v1(122.92,17.78)
ANJIAN3: length 136.4
  Top Layer w0.254: v1(55.5,56.9) 55.12,56.9 54.74,56.52 54.74,49.02 53.59,47.88 52.32,47.88 51.8,47.35 U1.10 ; R5.1 120.4,3.58 CN1.2 ; v1(79.76,39.24) 79.76,36.32 89.53,26.54 89.53,21.72 89.79,21.46 103.89,21.46 105.16,20.19 v1(119.25,20.19)
  Bottom Layer w0.254: CN1.2 120.42,19.03 v1(119.25,20.19) ; v1(55.5,56.9) 79.88,56.9 81.28,55.5 81.28,40.77 v1(79.76,39.24)
B: length 109.3
  Top Layer w0.254: v1(50.93,36.58) 42.93,36.58 42.42,37.08 42.42,44.2 42.81,44.59 U1.142 ; U10.7 117.26,60.87 116.2,59.82 116.2,53.34 115.32,52.45 109.47,52.45 v1(109.22,52.2)
  Bottom Layer w0.254: v1(50.93,36.58) 107.82,36.58 108.84,37.59 108.84,51.82 v1(109.22,52.2)
BI: length 186.8
  Top Layer w0.254: 124.92,60.22 127.03,60.22 127.56,60.76 127.56,61.01 v1(128.52,61.98) ; 162.31,61.98 162.31,59.69 163.83,58.17 163.83,45.09 164.59,44.32 168.91,44.32 P6.10 ; v1(159.26,61.98) 159.26,77.98 158.88,78.36 P2.10 ; P3.10 174.24,78.36 174.62,77.98 v1(174.62,61.98) ; P5.10 153.8,44.32 149.48,44.32 148.72,45.09 v1(148.72,61.98) ; 139.95,45.59 139.95,45.47 138.81,44.32 134.49,44.32 133.35,45.47 v1(133.35,61.98) v1(133.35,77.09)
  Bottom Layer w0.254: v1(128.52,61.98) v1(133.35,61.98) v1(148.72,61.98) v1(159.26,61.98) v1(162.27,61.98) v1(174.62,61.98) ; v1(133.35,77.09) 138.68,77.09 139.95,78.36
BUSY: length 112.2
  Top Layer w0.254: U1.49 86.43,49.59 86.87,49.15 86.87,35.94 89.79,33.02 135.89,33.02 139.7,29.21 139.7,12.03 141.06,10.68 U15.9
C: length 97.9
  Top Layer w0.254: U1.1 47.25,41.54 46.61,40.89 v1(46.61,37.85) ; U10.6 116.46,61.52 115.57,60.64 115.57,53.98 114.63,53.03 108.66,53.03 v1(108.2,52.58)
  Bottom Layer w0.254: v1(46.61,37.85) 46.66,37.8 106.38,37.8 107.44,38.86 107.44,51.69 108.2,52.45 v1(108.2,52.58)
CI: length 163.9
  Top Layer w0.254: P2.11 148.72,75.82 148.34,75.44 148.34,62.99 ; v1(148.31,62.99) 148.08,62.76 148.08,43.69 148.72,43.05 P5.11 ; 163.7,62.99 163.7,75.44 164.08,75.82 P3.11 ; v1(132.33,75.57) v1(132.33,62.99) 132.33,44.96 134.24,43.05 P4.11 ; 124.92,60.87 126.92,60.87 127.89,61.84 127.89,62.48 v1(128.4,62.99) ; P6.11 163.83,43.05 163.19,43.69 163.19,57.4 161.54,59.06 161.54,62.99
  Bottom Layer w0.254: P1.11 137.16,75.57 v1(132.33,75.57) ; v1(128.4,62.99) v1(132.33,62.99) v1(148.31,62.99) v1(161.54,62.99) v1(163.72,62.99)
D: length 95.6
  Top Layer w0.254: U1.2 47.8,40.13 47.62,39.96 v1(47.62,38.74) ; U10.5 116.15,62.17 114.94,60.96 114.94,54.74 113.79,53.59 v1(108.2,53.59)
  Bottom Layer w0.254: v1(47.62,38.74) 48.08,38.28 105.59,38.28 106.81,39.5 106.81,52.2 v1(108.2,53.59)
DB1: length 70.6
  Top Layer w0.254: U1.96 53.3,76.79 54.36,77.85 99.95,77.85 101.35,79.25 101.35,82.55 101.91,83.11 U7.6
DB2: length 65.9
  Top Layer w0.254: U7.9 103.39,81.16 102.87,80.65 102.87,78.36 100.84,76.33 56.77,76.33 55.8,75.36 U1.91
DB3: length 74.4
  Top Layer w0.254: U8.8 116.48,81.81 116.13,81.46 116.13,78.11 114.45,76.43 107.16,76.43 106.55,75.82 106.55,74.68 104.52,72.64 60.96,72.64 60.3,71.98 U1.82
DB4: length 74.4
  Top Layer w0.254: U7.3 100.18,85.06 99.69,84.58 99.69,80.39 98.68,79.38 52.83,79.38 51.8,78.34 U1.99
DB5: length 80.8
  Top Layer w0.254: U1.88 57.3,74.06 57.91,74.68 103.25,74.68 104.52,75.95 104.52,77.85 105.03,78.36 113.48,78.36 114.71,79.59 114.71,83.97 115.15,84.41 119.18,84.41
DB6: length 55.7
  Top Layer w0.254: U9.3 103.4,63.47 102.87,64.01 102.87,68.83 101.73,69.98 62.74,69.98 61.8,69.04 U1.79
DB7: length 53.5
  Top Layer w0.254: U9.6 102.31,61.52 101.47,62.36 101.47,67.82 100.84,68.45 63.75,68.45 63.3,68 U1.76
DB8: length 50
  Top Layer w0.254: U1.73 64.8,66.07 65.41,66.68 99.19,66.68 99.95,65.91 99.95,60.83 101.21,59.57 105.71,59.57
DB9: length 68.6
  Top Layer w0.254: U1.55 93.08,52.59 94.49,51.18 94.49,40.51 95.2,39.8 113.71,39.8 114.83,40.93 114.83,44.98 115.4,45.55 U12.4
DB10: length 66.1
  Top Layer w0.254: U12.7 116.63,43.6 115.9,42.88 115.9,40.49 114.15,38.73 93.73,38.73 92.71,39.75 92.71,49.4 92.03,50.09 U1.50
DB11: length 48.3
  Top Layer w0.254: U1.63 97.08,56.59 99.06,54.61 99.06,46.23 99.74,45.55 U11.4
DB12: length 48.8
  Top Layer w0.254: U11.7 97.88,43.6 97.28,44.2 97.28,53.72 96.92,54.09 U1.58
DBI1: length 40.2
  Top Layer w0.254: v1(113.28,82.46) U7.14
  Bottom Layer w0.254: P1.3 133.73,85.98 133.22,86.49 133.22,91.06 132.08,92.2 116.86,92.2 116.08,91.42 116.08,82.93 115.61,82.46 v1(113.28,82.46)
DBI2: length 43.7
  Top Layer w0.254: U7.11 112.9,80.51 v1(112.9,80.52)
  Bottom Layer w0.254: P1.7 132.84,80.9 131.32,82.42 131.32,90.04 130.68,90.68 118.75,90.68 117.98,89.92 117.98,81.41 117.09,80.52 v1(112.9,80.52)
DBI3: length 50.4
  Top Layer w0.254: 124.92,81.16 130.16,81.16 131.57,82.58 v1(131.57,96.39)
  Bottom Layer w0.254: v1(131.57,96.39) 145.41,96.39 148.34,93.47 148.34,86.49 148.84,85.98 P2.3
DBI4: length 61.5
  Top Layer w0.254: v1(112.65,84.41) 111.46,84.41
  Bottom Layer w0.254: v1(112.65,84.41) 113.88,84.41 114.3,84.84 114.3,93.36 115.17,94.23 144.65,94.23 146.43,92.46 146.43,82.42 147.95,80.9 P2.7
DBI5: length 66.1
  Top Layer w0.254: 124.92,83.76 128.15,83.76 129.03,84.65 v1(129.03,99.44)
  Bottom Layer w0.254: P3.3 166.62,85.98 165.61,87 165.61,89.41 159.26,95.76 159.26,97.92 157.73,99.44 v1(129.03,99.44)
DBI6: length 76.8
  Top Layer w0.254: U9.17 109.47,62.82
  Bottom Layer w0.254: P3.7 164.97,80.9 164.47,80.39 164.47,68.71 162.94,67.18 109.98,67.18 109.47,66.68 v1(109.47,62.79)
DBI7: length 36.1
  Top Layer w0.254: v1(108.58,60.83) 111.41,60.83 U9.14
  Bottom Layer w0.254: v1(108.58,60.83) 111,60.83 111.76,60.07 111.76,58.8 112.52,58.04 129.29,58.04 132.72,54.61 132.72,53.72 133.22,53.21 P4.3
DBI8: length 36.9
  Top Layer w0.254: v1(109.47,58.93) 111.45,58.93 U9.11
  Bottom Layer w0.254: P4.7 132.84,48.13 130.17,50.8 130.17,53.59 127.38,56.39 111.22,56.39 110.49,57.12 110.49,58.55 110.11,58.93 v1(109.47,58.93)
DBI9: length 55.8
  Top Layer w0.254: 124.92,44.9 126.82,44.9 127.38,45.47 v1(128.4,45.47)
  Bottom Layer w0.254: v1(128.4,45.47) 132.59,45.47 133.35,44.7 133.35,35.69 134.87,34.16 145.67,34.16 146.81,35.31 146.81,52.58 147.45,53.21 P5.3
DBI10: length 50.9
  Top Layer w0.254: v1(128.4,41.53) 126.97,42.95 124.92,42.95
  Bottom Layer w0.254: P5.7 149.73,48.13 149.1,47.5 149.1,34.04 147.07,32 132.84,32 131.19,33.66 131.19,40.77 130.43,41.53 v1(128.4,41.53)
DBI11: length 91.1
  Top Layer w0.254: v1(113.54,44.9) U11.16
  Bottom Layer w0.254: v1(113.54,44.9) 114.61,44.9 115.34,44.17 115.34,29.94 115.69,29.59 156.84,29.59 161.92,34.67 161.92,52.58 162.56,53.21 P6.3
DBI12: length 88.4
  Top Layer w0.254: U11.13 v1(112.9,42.95)
  Bottom Layer w0.254: P6.7 164.85,48.13 164.21,47.5 164.21,32.26 159.38,27.43 114.54,27.43 113.79,28.18 113.79,42.29 113.16,42.93 112.9,42.93 v1(112.9,42.95)
DG1: length 73.1
  Top Layer w0.254: 105.71,84.41 100.67,84.41 100.33,84.07 100.33,80.26 98.93,78.87 53.21,78.87 52.3,77.95 U1.98
DG2: length 67.2
  Top Layer w0.254: U7.8 103.12,81.81 102.36,81.05 102.36,78.61 100.58,76.84 56.01,76.84 55.3,76.13 U1.92
DG3: length 78
  Top Layer w0.254: U1.86 58.3,73.03 58.93,73.66 103.89,73.66 105.54,75.31 105.54,76.71 106.22,77.39 113.9,77.39 115.42,78.91 115.42,82.65 115.88,83.11 U8.6
DG4: length 75.7
  Top Layer w0.254: U7.2 105.7,85.73 99.57,85.73 99.06,85.22 99.06,80.52 98.42,79.88 52.32,79.88 51.3,78.86 U1.100
DG5: length 82.9
  Top Layer w0.254: U1.90 56.3,74.71 57.15,75.57 102.74,75.57 103.5,76.33 103.5,78.61 104.14,79.25 112.98,79.25 114,80.26 114,84.66 115.05,85.71 U8.2
DG6: length 79.6
  Top Layer w0.254: U1.87 57.8,73.8 58.17,74.17 103.63,74.17 105.03,75.57 105.03,77.34 105.56,77.88 113.75,77.88 115.06,79.19 115.06,83.19 115.64,83.76 U8.5
DG7: length 54.9
  Top Layer w0.254: U9.4 103.16,62.82 102.36,63.63 102.36,68.58 101.47,69.47 63.12,69.47 62.3,68.65 U1.78
DG8: length 52.5
  Top Layer w0.254: U9.7 101.69,60.87 100.97,61.6 100.97,67.44 100.58,67.82 64.39,67.82 63.8,67.23 U1.75
DG9: length 69.1
  Top Layer w0.254: U1.56 93.34,53.09 95,51.44 95,40.77 95.61,40.16 113.56,40.16 114.48,41.08 114.48,45.64 115.04,46.2 U12.3
DG10: length 67.3
  Top Layer w0.254: U1.53 91.8,51.59 93.34,50.04 93.34,40.01 94.26,39.09 114,39.09 115.55,40.63 115.55,43.59 116.2,44.25 U12.6
DG11: length 48.1
  Top Layer w0.254: U1.64 97.47,57.09 99.57,54.99 99.57,46.86 100.23,46.2 U11.3
DG12: length 48.4
  Top Layer w0.254: U1.59 97.18,54.59 97.92,53.85 97.92,44.96 98.62,44.25 U11.6
DGI1: length 40.5
  Top Layer w0.254: v1(113.28,83.76) U7.16
  Bottom Layer w0.254: 139.95,88.52 139.95,89.41 139.32,90.04 135.51,90.04 134.75,90.81 134.75,91.57 132.84,93.47 115.65,93.47 114.81,92.63 114.81,84.2 114.37,83.76 v1(113.28,83.76)
DGI2: length 46.7
  Top Layer w0.254: U7.12 v1(113.41,81.16)
  Bottom Layer w0.254: 139.95,83.44 138.68,82.17 132.59,82.17 131.95,82.8 131.95,90.42 131.19,91.19 118.06,91.19 117.35,90.47 117.35,81.79 116.59,81.03 113.41,81.03 v1(113.41,81.16)
DGI3: length 51.5
  Top Layer w0.254: 124.92,82.46 129.48,82.46 130.3,83.29 v1(130.3,97.92)
  Bottom Layer w0.254: P2.2 155.07,89.41 154.43,90.04 150.62,90.04 149.86,90.81 149.86,94.23 146.18,97.92 v1(130.3,97.92)
DGI4: length 64.5
  Top Layer w0.254: v1(113.28,85.06) U7.18
  Bottom Layer w0.254: v1(113.28,85.06) 113.38,85.06 113.66,85.34 113.66,94.17 114.36,94.87 145.03,94.87 147.07,92.84 147.07,82.8 147.7,82.17 153.8,82.17 P2.6
DGI5: length 67.9
  Top Layer w0.254: v1(127.76,100.84) 127.76,85.73 127.1,85.06 124.92,85.06
  Bottom Layer w0.254: P3.2 170.18,89.92 169.54,90.55 166.37,90.55 160.53,96.39 160.53,98.68 158.37,100.84 v1(127.76,100.84)
DGI6: length 70.3
  Top Layer w0.254: 124.92,83.11 128.67,83.11 129.67,84.11 v1(129.67,98.68)
  Bottom Layer w0.254: P3.6 170.18,83.69 169.16,84.71 165.23,84.71 164.72,85.22 164.72,89.28 158.5,95.5 158.5,97.66 157.48,98.68 v1(129.67,98.68)
DGI7: length 38.5
  Top Layer w0.254: U9.16 v1(108.46,62.17)
  Bottom Layer w0.254: v1(108.46,62.17) 112.14,62.17 112.65,61.67 112.65,59.45 113.04,59.06 131.57,59.06 133.35,57.28 138.43,57.28 139.95,55.75
DGI8: length 38.5
  Top Layer w0.254: v1(109.35,60.2) 111.43,60.2 U9.13
  Bottom Layer w0.254: v1(109.35,60.2) 110.74,60.2 111.38,59.56 111.38,58.3 112.15,57.53 128.52,57.53 131.7,54.36 131.7,52.45 132.21,51.94 138.68,51.94 139.95,50.67
DGI9: length 61.1
  Top Layer w0.254: v1(128.52,46.86) 127.38,46.86 127,46.48 127,46.1 126.45,45.55 124.92,45.55
  Bottom Layer w0.254: v1(128.52,46.86) 133.48,46.86 134.11,46.23 134.11,35.94 135.38,34.67 145.03,34.67 146.05,35.69 146.05,53.47 147.07,54.48 153.8,54.48 P5.2
DGI10: length 55
  Top Layer w0.254: 124.92,43.6 127.72,43.6 v1(128.4,42.93)
  Bottom Layer w0.254: v1(128.4,42.93) 131.32,42.93 131.83,42.42 131.83,34.29 133.22,32.89 146.56,32.89 148.34,34.67 148.34,48.77 148.97,49.4 153.8,49.4 P5.6
DGI11: length 94.2
  Top Layer w0.254: v1(112.9,45.55) U11.17
  Bottom Layer w0.254: P6.2 168.91,54.48 162.18,54.48 161.16,53.47 161.16,35.69 155.83,30.35 116.2,30.35 115.82,30.73 115.82,44.83 115.1,45.55 v1(112.9,45.55)
DGI12: length 91.9
  Top Layer w0.254: v1(113.41,43.6) U11.14
  Bottom Layer w0.254: v1(113.41,43.6) 113.75,43.6 114.3,43.05 114.3,28.9 115.01,28.19 158.62,28.19 163.45,33.02 163.45,48.77 164.08,49.4 168.91,49.4 P6.6
DI: length 190.3
  Top Layer w0.254: 124.92,61.52 127.06,61.52 127.51,61.98 127.51,62.99 127.89,63.37 127.89,63.75 v1(128.02,63.88) ; P3.12 172.72,75.82 173.74,74.8 v1(173.74,64.39) ; 139.95,43.05 138.68,41.78 133.48,41.78 131.44,43.82 v1(131.44,63.88) v1(131.44,74.17) ; v1(146.81,63.88) 146.81,42.93 147.95,41.78 153.8,41.78 P5.12 ; P2.12 158.11,75.82 158.5,75.44 158.5,63.88 ; P6.12 168.91,41.78 163.58,41.78 162.43,42.93 162.43,56.52 160.91,58.04 160.91,63.88
  Bottom Layer w0.254: 139.95,75.82 138.68,74.55 131.83,74.55 v1(131.44,74.17) ; v1(173.74,64.39) 173.23,63.88 v1(160.87,63.88) v1(158.51,63.88) v1(146.81,63.88) v1(131.44,63.88) v1(128.02,63.88)
DR1: length 72.1
  Top Layer w0.254: U7.5 101.04,83.76 100.84,83.57 100.84,79.63 99.57,78.36 53.85,78.36 52.8,77.31 U1.97
DR2: length 68.8
  Top Layer w0.254: U7.7 102.4,82.46 101.85,81.92 101.85,78.87 100.33,77.34 55.19,77.34 54.8,76.95 U1.93
DR3: length 77
  Top Layer w0.254: U1.85 58.8,72.77 ; 58.8,72.77 59.18,73.15 104.27,73.15 106.04,74.93 106.04,76.45 106.5,76.91 114.17,76.91 115.77,78.51 115.77,81.99 116.25,82.46 U8.7 ; 58.8,72.77 58.8,72.77
DR4: length 73.5
  Top Layer w0.254: U8.9 117.09,81.16 116.49,80.56 116.49,77.71 114.72,75.94 107.57,75.94 107.19,75.57 107.19,74.04 105.28,72.14 61.21,72.14 60.8,71.72 ; 60.8,71.76 60.8,71.72 ; 60.8,71.72 U1.81
DR5: length 82
  Top Layer w0.254: U1.89 56.8,74.45 57.42,75.08 102.89,75.08 103.99,76.18 103.99,78.26 104.5,78.77 113.25,78.77 114.35,79.86 114.35,84.51 114.9,85.06 U8.3
DR6: length 56.2
  Top Layer w0.254: U1.80 61.3,69.43 62.36,70.49 101.85,70.49 103.25,69.09 103.25,64.9 104.02,64.12 U9.2
DR7: length 54.3
  Top Layer w0.254: U9.5 102.8,62.17 101.98,62.99 101.98,68.2 101.22,68.96 63.37,68.96 62.8,68.39 U1.77
DR8: length 51.3
  Top Layer w0.254: U1.74 64.3,66.84 64.64,67.18 99.95,67.18 100.46,66.68 100.46,61.21 101.45,60.22 U9.8
DR9: length 69.8
  Top Layer w0.254: 119.18,46.85 114.67,46.85 114.12,46.3 114.12,41.22 113.41,40.51 96.01,40.51 95.5,41.02 95.5,52.07 93.99,53.59 U1.57
DR10: length 68.2
  Top Layer w0.254: U12.5 115.64,44.9 115.19,44.45 115.19,40.78 113.85,39.45 94.67,39.45 93.98,40.13 93.98,50.8 92.69,52.09 U1.54
DR11: length 47.9
  Top Layer w0.254: U1.65 97.86,57.59 100.08,55.37 100.08,47.63 100.85,46.85 105.71,46.85
DR12: length 48.3
  Top Layer w0.254: U1.60 97.82,55.09 98.42,54.48 98.42,45.59 99.12,44.9 U11.5
DRI1: length 37.8
  Top Layer w0.254: v1(112.78,83.11) U7.15
  Bottom Layer w0.254: P1.1 134.75,88.52 133.98,89.28 133.98,91.19 132.33,92.84 116.28,92.84 115.44,92 115.44,83.69 114.86,83.11 v1(112.78,83.11)
DRI2: length 42.5
  Top Layer w0.254: v1(112.78,81.81) U7.13
  Bottom Layer w0.254: v1(112.78,81.81) 116.23,81.81 116.71,82.3 116.71,90.9 117.51,91.69 131.57,91.69 132.59,90.68 132.59,83.82 132.97,83.44 P1.5
DRI3: length 48.7
  Top Layer w0.254: v1(130.94,97.16) 130.94,82.63 130.12,81.81 124.92,81.81
  Bottom Layer w0.254: v1(130.94,97.16) 145.8,97.16 149.1,93.85 149.1,89.28 149.86,88.52 P2.1
DRI4: length 52.2
  Top Layer w0.254: 124.92,80.51 130.38,80.51 132.21,82.35 v1(132.21,95.63)
  Bottom Layer w0.254: v1(132.21,95.63) 145.29,95.63 147.7,93.22 147.7,83.82 148.08,83.44 P2.5
DRI5: length 64.1
  Top Layer w0.254: v1(128.4,100.08) 128.4,85.17 127.64,84.41 124.92,84.41
  Bottom Layer w0.254: v1(128.4,100.08) 158.11,100.08 159.89,98.3 159.89,96.01 167.39,88.52 P3.1
DRI6: length 80.2
  Top Layer w0.254: U9.18 v1(108.58,63.47)
  Bottom Layer w0.254: v1(108.58,63.47) 108.58,67.06 109.35,67.82 162.31,67.82 163.83,69.34 163.83,82.8 164.47,83.44 P3.5
DRI7: length 33.6
  Top Layer w0.254: U9.15 v1(109.47,61.52)
  Bottom Layer w0.254: P4.1 133.1,55.75 130.3,58.55 112.65,58.55 112.14,59.06 112.14,61.09 111.63,61.6 109.47,61.6 v1(109.47,61.52)
DRI8: length 37.9
  Top Layer w0.254: 111.46,59.57 v1(108.58,59.57)
  Bottom Layer w0.254: P4.5 131.44,50.67 130.94,51.18 130.94,54.1 128.02,57.02 111.77,57.02 111,57.79 111,58.8 110.24,59.56 108.71,59.56 108.58,59.69 v1(108.58,59.57)
DRI9: length 59.2
  Top Layer w0.254: v1(128.4,48.01) 127.13,48.01 126.62,47.5 126.62,46.48 126.34,46.2 124.92,46.2
  Bottom Layer w0.254: v1(128.4,48.01) 131.32,48.01 131.95,47.37 134.11,47.37 134.75,46.74 134.75,36.58 135.89,35.43 144.78,35.43 145.41,36.07 145.41,54.23 146.81,55.63 152.4,55.63 P5.1
DRI10: length 53.2
  Top Layer w0.254: 124.92,44.25 128.34,44.25 v1(128.52,44.07)
  Bottom Layer w0.254: v1(128.52,44.07) 132.21,44.07 132.72,43.56 132.72,34.8 133.86,33.66 146.18,33.66 147.7,35.18 147.7,50.42 148.08,50.8 152.4,50.8 P5.5
DRI11: length 91.3
  Top Layer w0.254: v1(113.54,46.2) U11.18
  Bottom Layer w0.254: P6.1 167.51,55.63 161.92,55.63 160.53,54.23 160.53,36.07 155.7,31.24 116.59,31.24 116.33,31.5 116.33,45.34 115.47,46.2 v1(113.54,46.2)
DRI12: length 89.6
  Top Layer w0.254: v1(112.9,44.25) U11.15
  Bottom Layer w0.254: P6.5 167.51,50.8 163.19,50.8 162.81,50.42 162.81,34.04 157.73,28.96 115.2,28.96 114.81,29.34 114.81,43.69 114.24,44.25 v1(112.9,44.25)
E: length 96.2
  Top Layer w0.254: 119.18,59.57 117.98,59.57 117.47,59.07 117.47,51.94 116.71,51.18 v1(108.2,51.18) ; U1.3 48.3,37.56 48.64,37.21 v1(52.07,37.21)
  Bottom Layer w0.254: v1(108.2,51.18) 108.2,37.97 107.44,37.21 v1(52.07,37.21)
EI: length 181.2
  Top Layer w0.254: P5.8 153.8,46.86 151,46.86 150.24,47.63 v1(150.24,59.82) ; P6.8 168.91,46.86 166.12,46.86 165.35,47.63 v1(165.35,59.82) ; v1(160.15,59.82) 160.15,80.14 159.38,80.9 P2.8 ; 124.92,58.92 128.14,58.92 128.4,59.18 v1(128.4,59.82) ; P3.8 174.75,80.9 175.64,80.01 175.64,60.58 v1(174.88,59.82) ; 139.95,80.9 138.68,79.63 135.64,79.63 135.25,79.25 v1(135.25,59.82) 135.25,47.37 135.76,46.86 138.68,46.86 139.95,48.13
  Bottom Layer w0.254: v1(128.4,59.82) v1(135.25,59.82) v1(150.24,59.82) v1(160.15,59.82) v1(165.35,59.82) v1(174.88,59.82)
ETH_MDC: length 81.4
  Top Layer w0.254: U1.27 60.3,44.48 v1(59.69,45.09) ; U2.31 18.29,76.08 17.91,75.69 v1(17.91,58.17)
  Bottom Layer w0.254: v1(59.69,45.09) 18.8,45.09 17.91,45.97 v1(17.91,58.17)
ETH_MDIO: length 87.5
  Top Layer w0.254: v1(17.27,58.8) 17.27,76.2 17.65,76.58 U2.30 ; U1.36 v1(64.8,43.94)
  Bottom Layer w0.254: v1(64.8,43.94) 64.29,44.45 18.54,44.45 17.27,45.72 v1(17.27,58.8)
ETH_RESET: length 54.8
  Top Layer w0.254: U1.117 17.46,57.09 16.51,58.04 16.51,76.45 17.13,77.08 U2.29
IIC_SCL: length 45.1
  Top Layer w0.254: 54.48,21.97 53.85,21.97 v1(53.34,22.48) ; 54.48,21.97 54.99,22.48 U16.6 ; 54.48,21.97 R45.2 ; U1.139 41.39,46.09 40.39,45.09 v1(40.39,40.39)
  Bottom Layer w0.254: v1(40.39,40.39) 40.39,29.21 41.66,27.94 52.77,27.94 53.34,27.37 v1(53.34,22.48)
IIC_SDA: length 45.4
  Top Layer w0.254: R49.2 52.07,23.11 52.71,23.75 v1(54.12,23.75) U16.5 ; U1.140 41.78,45.59 41.02,44.83 v1(41.02,42.42)
  Bottom Layer w0.254: 54.1,23.75 54.1,27.69 53.09,28.7 41.78,28.7 40.89,29.59 40.89,39.75 41.15,40.01 41.15,41.02 41.02,41.15 v1(41.02,42.42)
JTCK: length 44.2
  Top Layer w0.254: v1(19.94,60.71) 20.32,61.09 U1.109 ; R27.1 10.94,63.5 v1(8.94,63.5) 5.59,63.5
  Bottom Layer w0.254: v1(19.94,60.71) 19.94,62.23 19.68,62.48 10.79,62.48 9.78,63.5 v1(8.94,63.5)
JTDI: length 42.7
  Top Layer w0.254: U1.110 20.84,60.59 19.81,59.56 v1(19.18,59.56) ; 5.59,58.42 v1(9.27,58.42) R24.1
  Bottom Layer w0.254: v1(9.27,58.42) 9.27,58.8 10.03,59.56 v1(19.18,59.56)
JTDO: length 92.5
  Top Layer w0.254: R26.1 5.59,68.58 ; v1(48.51,31.88) U13.6 ; v1(8.38,51.05) 10.35,49.09 U1.133 47.05,49.09 48.13,48.01 v1(48.13,43.69)
  Bottom Layer w0.254: JTAG1.13 6.35,68.58 7.75,67.18 7.75,51.69 v1(8.38,51.05) ; v1(48.13,43.69) 47.5,43.05 43.94,43.05 43.56,42.67 43.56,32.39 44.07,31.88 v1(48.51,31.88)
JTMS: length 50.7
  Top Layer w0.254: 5.59,60.96 5.71,60.83 v1(9.14,60.83) R25.1 ; U1.105 48.8,65.25 48.39,65.66 31.37,65.66 29.84,64.14 29.84,62.61 28.83,61.6 v1(18.92,61.6)
  Bottom Layer w0.254: v1(18.92,61.6) 18.92,61.72 10.03,61.72 v1(9.14,60.83)
JTRST: length 67.6
  Top Layer w0.254: 38.73,48.59 9.58,48.59 v1(9.02,49.15) ; 38.73,48.59 38.73,35.56 41.15,33.15 U13.2 ; 38.73,48.59 U1.134 ; R23.1 v1(9.01,56.01) 5.71,56.01 5.59,55.88
  Bottom Layer w0.254: v1(9.02,49.15) 9.02,56.01
LCP: length 59.6
  Top Layer w0.254: U1.68 88.04,59.09 88.65,59.7 98.29,59.7 101.47,56.52 112.78,56.52 113.79,57.53 113.79,62.36 114.94,63.5 119.15,63.5 U10.3
LCPI: length 198.2
  Top Layer w0.254: P5.14 153.8,39.24 145.92,39.24 145.03,40.13 145.03,65.91 ; P3.14 172.47,73.28 172.97,72.77 v1(172.97,66.17) ; P6.14 168.91,39.24 161.92,39.24 160.4,40.77 160.4,54.99 156.84,58.55 v1(156.84,65.91) ; P2.14 157.35,73.28 157.73,72.9 157.73,65.91 ; 139.95,40.51 139.95,40.13 139.06,39.24 131.95,39.24 130.05,41.15 v1(130.05,65.91) 130.05,71.12 v1(129.16,72.01) ; 124.92,62.82 126.2,62.82 127.08,63.7 127.08,65.48 v1(127.51,65.91)
  Bottom Layer w0.254: v1(127.51,65.91) v1(130.05,65.91) v1(145.05,65.91) v1(156.84,65.91) v1(157.75,65.91) 172.72,65.91 v1(172.97,66.17) ; 139.95,73.28 138.68,72.01 v1(129.16,72.01)
LED1: length 8.4
  Top Layer w0.254: U1.37 66.85,35.18
LED_LINK: length 54.8
  Top Layer w0.254: U2.28 15.64,77.58 13.97,79.25 13.97,92.2 18.54,96.77 20.32,96.77 22.99,99.44 22.99,100.71 24.64,102.36 35.56,102.36 36.2,103 36.2,104.78 35.69,105.28 R21.1
LEDACT_LINK: length 56.4
  Top Layer w0.254: R22.1 36.2,107.44 36.96,106.68 36.96,102.62 36.07,101.73 25.15,101.73 23.62,100.2 23.62,99.06 20.83,96.27 18.67,96.27 14.6,92.2 14.6,79.88 15.91,78.58 U2.26
LIGHT_SENSOR: length 89.8
  Top Layer w0.254: R11.1 108.69,11.18 v1(110.36,11.18) ; U1.47 70.94,48.59 71.37,49.02 78.74,49.02 79.38,48.39 79.38,42.29 78.99,41.91 75.06,41.91 74.04,40.89 74.04,29.59 74.55,29.08 86.11,29.08 87.76,27.43 87.76,20.45 88.52,19.69 102.74,19.69 105.16,17.27 v1(110.36,17.27)
  Bottom Layer w0.254: v1(110.36,11.18) v1(110.36,17.27)
MODE1: length 97.3
  Top Layer w0.254: v1(115.44,23.24) 106.43,23.24 104.27,25.4 92.96,25.4 82.55,35.81 82.55,39.75 82.17,40.13 v1(77.85,40.13) ; v1(72.52,45.72) 72.14,45.34 70.61,45.34 70.36,45.09 U1.40 ; H2.1 131.32,8.25 129.41,8.25 129.13,8.54 R31.1
  Bottom Layer w0.254: v1(77.85,40.13) 77.34,40.64 77.34,45.21 76.83,45.72 v1(72.52,45.72) ; H2.1 132.59,15.37 124.71,23.24 v1(115.44,23.24)
MODE2: length 98.3
  Top Layer w0.254: H2.2 133.48,8.64 133.08,8.64 R32.1 ; v1(78.49,41.02) 82.3,41.02 83.19,40.13 83.19,36.07 93.22,26.03 104.77,26.03 106.81,24 v1(116.46,24) ; v1(72.77,46.61) 71.12,46.61 70.1,45.59 U1.41
  Bottom Layer w0.254: v1(78.49,41.02) 77.98,41.53 77.98,45.59 76.96,46.61 v1(72.77,46.61) ; H2.2 135.13,13.84 124.97,24 v1(116.46,24)
MODE3: length 100.1
  Top Layer w0.254: R33.1 134.72,9.43 135.76,8.38 136.27,8.38 H2.3 ; v1(73.02,47.37) 70.99,47.37 69.71,46.09 U1.42 ; v1(117.6,24.64) 107.31,24.64 105.16,26.8 93.22,26.8 83.82,36.2 83.82,40.89 82.93,41.78 v1(80.01,41.78)
  Bottom Layer w0.254: v1(117.6,24.64) 125.48,24.64 137.67,12.45 H2.3 ; v1(80.01,41.78) 79.88,41.78 78.74,42.93 78.74,45.85 77.22,47.37 v1(73.02,47.37)
MODE4: length 102.7
  Top Layer w0.254: v1(80.39,43.05) 83.06,43.05 84.45,41.66 84.45,36.32 93.22,27.56 105.66,27.56 107.7,25.53 v1(118.87,25.53) ; H2.4 140.21,9.4 139.81,9.8 R34.1 ; v1(75.31,48.01) 75.23,48.09 U1.46
  Bottom Layer w0.254: H2.4 140.21,11.18 125.86,25.53 v1(118.87,25.53) ; v1(75.31,48.01) 77.6,48.01 79.5,46.1 79.5,43.69 80.14,43.05 v1(80.39,43.05)
OE_OWM: length 61.1
  Top Layer w0.254: v1(96.52,58.29) 96.31,58.09 U1.66 ; U10.2 119.16,64.14 114.55,64.14 113.28,62.87 113.28,57.91 112.39,57.02 101.85,57.02 98.55,60.33 v1(98.04,60.33)
  Bottom Layer w0.254: v1(96.52,58.29) 96.52,59.44 97.41,60.33 v1(98.04,60.33)
OE_PWMI: length 176.9
  Top Layer w0.254: 165.35,66.55 165.35,70.1 165.99,70.74 P3.15 ; 124.92,63.47 126.08,63.47 126.62,64.01 126.62,66.29 127,66.68 128.14,66.68 128.27,66.55 129.25,66.55 v1(129.29,66.51) ; v1(129.29,66.51) 129.29,39.75 131.06,37.97 P4.15 ; v1(129.29,66.51) v1(129.29,68.58) ; P2.15 150.88,70.74 150.37,70.23 150.37,66.55 ; 155.57,66.55 155.57,58.67 159.64,54.61 159.64,38.99 160.66,37.97 P6.15 ; P5.15 144.91,37.97 144.02,38.86 v1(144.02,66.55)
  Bottom Layer w0.254: v1(129.29,66.51) v1(150.38,66.51) v1(155.57,66.51) v1(165.34,66.51) ; P1.15 130.3,70.74 129.29,69.72 v1(129.29,68.58)
OUT1: length 102.1
  Top Layer w0.254: v1(42.67,58.42) 43.34,59.09 U1.113
  Bottom Layer w0.254: CN5.4 95.83,96.71 94.61,95.5 49.78,95.5 49.4,95.12 49.4,72.14 48.64,71.37 43.81,71.37 43.43,70.99 43.43,59.18 v1(42.67,58.42)
OUT2: length 99.1
  Top Layer w0.254: v1(42.29,59.18) 42.7,59.59 U1.112
  Bottom Layer w0.254: v1(42.29,59.18) 42.93,59.82 42.93,71.12 43.56,71.76 48.39,71.76 48.9,72.26 48.9,95.38 49.53,96.01 91.57,96.01 93.33,97.77 CN5.3
OUT3: length 97.6
  Top Layer w0.254: U1.111 41.8,60.09 v1(41.4,59.69)
  Bottom Layer w0.254: CN5.2 90.81,106.54 90.81,98.18 89.15,96.52 49.28,96.52 48.39,95.63 48.39,72.63 47.89,72.14 43.43,72.14 42.42,71.12 42.42,60.2 41.91,59.69 v1(41.4,59.69)
PFB: length 38.2
  Top Layer w0.254: v1(26.8,83.82) 27.81,82.81 U2.18 27.81,78.49 28.19,78.11 28.19,75.18 ; 28.19,75.18 26.54,75.18 25.9,75.82 25.9,78.49 25.31,79.09 U2.23 ; 28.19,75.18 27.3,74.3 25.27,74.3 24.81,73.83 U2.37 24.81,68.38 24.76,68.34 26.8,68.34 ; C31.2 32.31,85.42 C30.2 32.31,82.35 31.88,81.92 v1(31.37,81.92)
  Bottom Layer w0.254: v1(31.37,81.92) 30.99,82.3 30.99,83.31 30.48,83.82 v1(26.8,83.82)
RD+: length 27.6
  Top Layer w0.254: U2.14 29.81,86.02 28.07,87.76 24.13,87.76 23.49,88.39 23.49,92.67 J1.3 23.5,93.48 24,93.98 27.18,93.98 27.67,93.5 30.84,93.5 31.5,92.84 R18.2
RD-: length 36.2
  Top Layer w0.254: v1(26.67,88.65) 28.32,88.65 30.31,86.66 U2.13 ; J1.6 19.69,93.73 20.45,94.49 27.18,94.49 27.81,93.85 30.23,93.85 31.24,94.87 R17.2
  Bottom Layer w0.254: v1(26.67,88.65) 20.32,88.65 19.69,89.28 J1.6
RESET: length 141.9
  Top Layer w0.254: 64.39,25.18 64.39,21.84 v1(65.15,21.08) ; 64.39,25.18 64.35,25.15 41.02,25.15 39.5,26.67 39.5,31.75 38.86,32.39 38.86,34.04 37.46,35.43 37.46,43.56 35.31,45.72 23.49,45.72 22.73,46.48 v1(22.73,46.99) ; 64.39,25.18 64.39,34.93 62.99,36.32 59.82,36.32 59.3,36.84 U1.25 ; 74.93,20.45 76.96,20.45 77.34,20.83 77.34,23.48 R9.2 C16.1 ; v1(19.18,64.9) 22.23,64.9 22.73,64.39 v1(22.73,62.87)
  Bottom Layer w0.254: 74.93,20.45 65.79,20.45 v1(65.15,21.08) ; v1(19.18,64.9) 10.79,64.9 9.91,65.79 9.91,69.98 8.76,71.12 JTAG1.15 ; v1(22.73,62.87) v1(22.73,46.99)
RMII_CLK: length 79.5
  Top Layer w0.254: v1(63.88,45.21) 63.88,43.43 64.3,43.02 U1.35 ; X2.3 v1(20.72,73.05) 20.72,74.17 21.12,74.58 U2.34
  Bottom Layer w0.254: v1(63.88,45.21) 63.88,45.34 63.52,45.34 63.19,45.67 21.9,45.67 20.72,46.85 v1(20.72,73.05)
RMII_CRS_DV: length 70.3
  Top Layer w0.254: v1(63.5,46.23) 64.26,46.23 64.62,46.59 U1.43 ; U2.39 v1(25.81,70.05) 26.27,69.6 28.32,69.6 28.88,69.04 28.88,68.23
  Bottom Layer w0.254: 25.78,70.1 26.67,69.22 26.67,47.63 28.07,46.23 v1(63.5,46.23)
RMII_RXD0: length 64.4
  Top Layer w0.254: U2.43 27.81,70.99 v1(27.43,70.61) ; v1(62.23,46.86) 64.05,46.86 64.27,47.09 U1.44
  Bottom Layer w0.254: v1(62.23,46.86) 28.57,46.86 27.43,48.01 v1(27.43,70.61)
RMII_RXD1: length 63.1
  Top Layer w0.254: U1.45 v1(63.12,47.59) ; v1(28.32,70.36) 28.31,70.37 U2.44
  Bottom Layer w0.254: v1(28.32,70.36) 28.07,70.1 28.07,48.64 29.21,47.5 63.12,47.5 v1(63.12,47.59)
RMII_TX_EN: length 34.4
  Top Layer w0.254: U2.2 33.15,74.08 33.95,73.28 v1(35.94,73.28) ; v1(35.94,53.72) 35.94,53.09 36.44,52.59 U1.126
  Bottom Layer w0.254: v1(35.94,73.28) v1(35.94,53.72)
RMII_TXD0: length 35.9
  Top Layer w0.254: v1(35.31,74.3) 33.65,74.3 33.37,74.58 U2.3 ; U1.128 36.3,51.59 35.31,52.58 v1(35.31,53.09)
  Bottom Layer w0.254: v1(35.31,74.3) v1(35.31,53.09)
